# Altium schematic sheet [17]-ETH_CONNECTOR.SchDoc
size A4
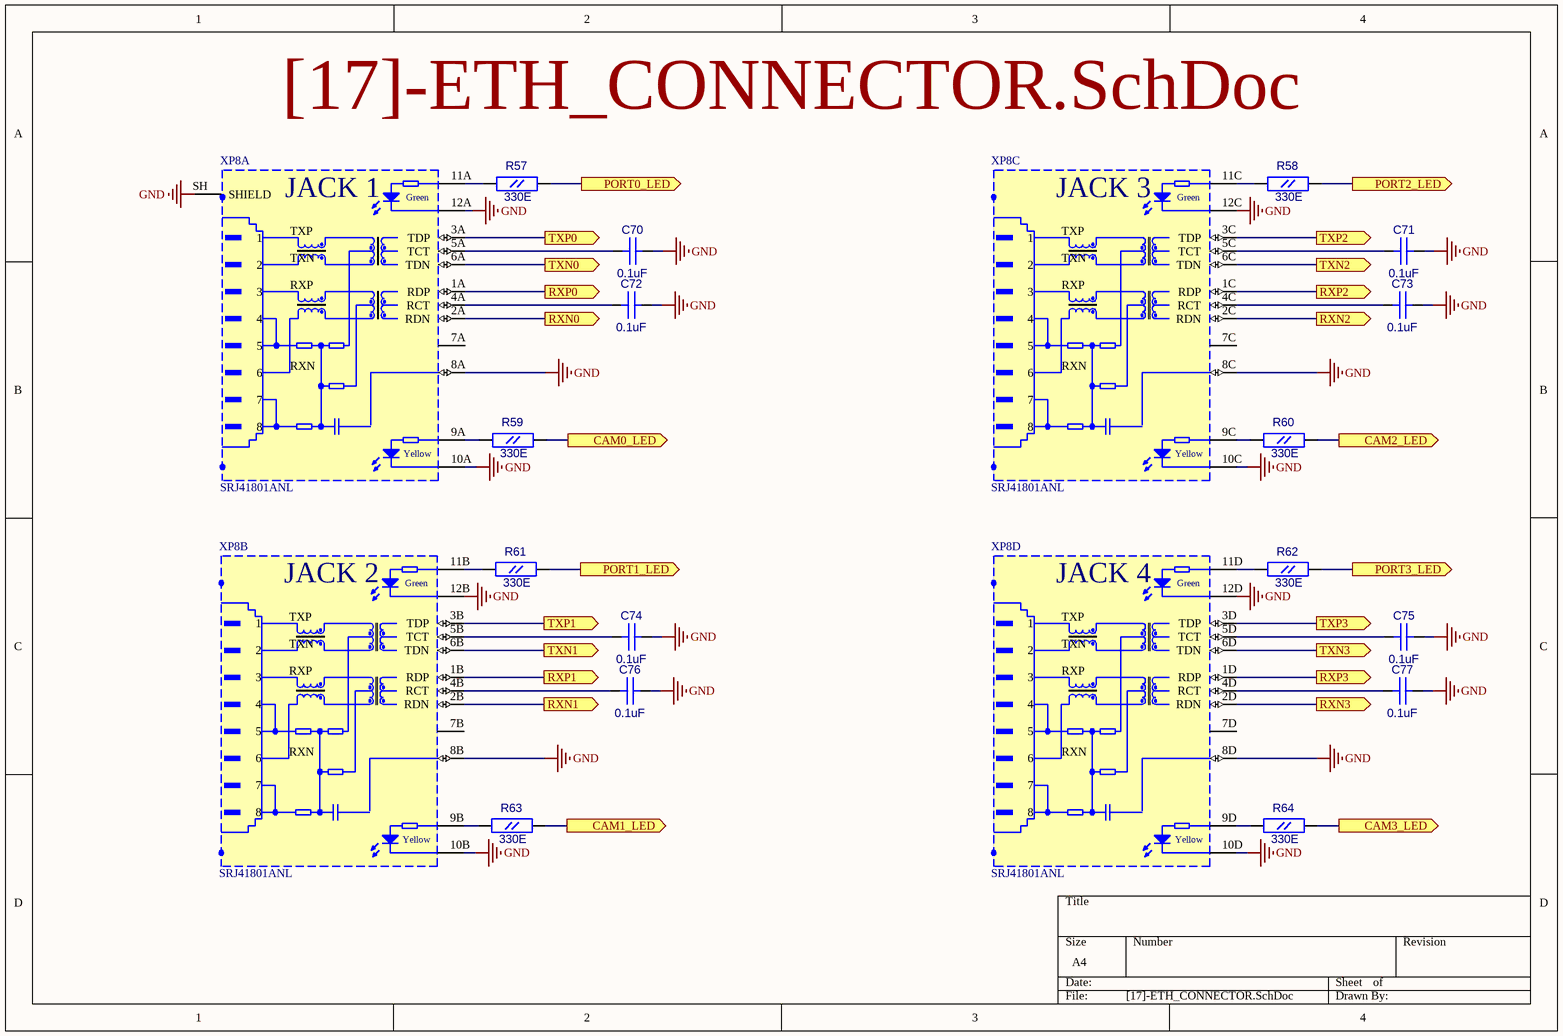
[diagram p0: [17]-ETH_CONNECTOR.SchDoc]

## Parts
C70  0.1uF  [CC0603]
C71  0.1uF  [CC0603]
C72  0.1uF  [CC0603]
C73  0.1uF  [CC0603]
C74  0.1uF  [CC0603]
C75  0.1uF  [CC0603]
C76  0.1uF  [CC0603]
C77  0.1uF  [CC0603]
R57  330E  [RC0603]
R58  330E  [RC0603]
R59  330E  [RC0603]
R60  330E  [RC0603]
R61  330E  [RC0603]
R62  330E  [RC0603]
R63  330E  [RC0603]
R64  330E  [RC0603]
XP8  SRJ41801ANL  [ETHERNET_RJ45_4PORTS]  (parts A,B,C,D of 4)

## Ports
CAM0_LED (out), CAM1_LED (out), CAM2_LED (out), CAM3_LED (out), PORT0_LED (out), PORT1_LED (out), PORT2_LED (out), PORT3_LED (out), RXN0 (out), RXN1 (out), RXN2 (out), RXN3 (out), RXP0 (out), RXP1 (out), RXP2 (out), RXP3 (out), TXN0 (out), TXN1 (out), TXN2 (out), TXN3 (out), TXP0 (out), TXP1 (out), TXP2 (out), TXP3 (out)

## Nets
GND: C70.2(B) C71.2(B) C72.2(B) C73.2(B) C74.2(B) C75.2(B) C76.2(B) C77.2(B) XP8.8A XP8.8B XP8.8C XP8.8D XP8.10A(D4) XP8.10B(D4) XP8.10C(D4) XP8.10D(D4) XP8.12A(D2) XP8.12B(D2) XP8.12C(D2) XP8.12D(D2) XP8.SH(SHIELD)
CAM0_LED: R59.2(B) ; port CAM0_LED
CAM1_LED: R63.2(B) ; port CAM1_LED
CAM2_LED: R60.2(B) ; port CAM2_LED
CAM3_LED: R64.2(B) ; port CAM3_LED
PORT0_LED: R57.2(B) ; port PORT0_LED
PORT1_LED: R61.2(B) ; port PORT1_LED
PORT2_LED: R58.2(B) ; port PORT2_LED
PORT3_LED: R62.2(B) ; port PORT3_LED
RXN0: XP8.2A(RDN) ; port RXN0
RXN1: XP8.2B(RDN) ; port RXN1
RXN2: XP8.2C(RDN) ; port RXN2
RXN3: XP8.2D(RDN) ; port RXN3
RXP0: XP8.1A(RDP) ; port RXP0
RXP1: XP8.1B(RDP) ; port RXP1
RXP2: XP8.1C(RDP) ; port RXP2
RXP3: XP8.1D(RDP) ; port RXP3
TXN0: XP8.6A(TDN) ; port TXN0
TXN1: XP8.6B(TDN) ; port TXN1
TXN2: XP8.6C(TDN) ; port TXN2
TXN3: XP8.6D(TDN) ; port TXN3
TXP0: XP8.3A(TDP) ; port TXP0
TXP1: XP8.3B(TDP) ; port TXP1
TXP2: XP8.3C(TDP) ; port TXP2
TXP3: XP8.3D(TDP) ; port TXP3
NetC70_1: C70.1(A) XP8.5A(TCT)
NetC71_1: C71.1(A) XP8.5C(TCT)
NetC72_1: C72.1(A) XP8.4A(RCT)
NetC73_1: C73.1(A) XP8.4C(RCT)
NetC74_1: C74.1(A) XP8.5B(TCT)
NetC75_1: C75.1(A) XP8.5D(TCT)
NetC76_1: C76.1(A) XP8.4B(RCT)
NetC77_1: C77.1(A) XP8.4D(RCT)
NetR57_1: R57.1(A) XP8.11A(D1)
NetR58_1: R58.1(A) XP8.11C(D1)
NetR59_1: R59.1(A) XP8.9A(D3)
NetR60_1: R60.1(A) XP8.9C(D3)
NetR61_1: R61.1(A) XP8.11B(D1)
NetR62_1: R62.1(A) XP8.11D(D1)
NetR63_1: R63.1(A) XP8.9B(D3)
NetR64_1: R64.1(A) XP8.9D(D3)

Not connected (* = marked no-connect by the designer): XP8 7A(7) 7B(7) 7C(7) 7D(7)

## Notes on the sheet
- (in symbol SRJ41801ANL, part A) Green; JACK 1; TXP; 1; TXN; 2; RXP; 3; 4; 5; RXN; 6; Yellow
- (in symbol SRJ41801ANL, part B) Green; JACK 2; TXP; 1; TXN; 2; RXP; 3; 4; 5; RXN; 6; Yellow
- (in symbol SRJ41801ANL, part C) Green; JACK 3; TXP; 1; TXN; 2; RXP; 3; 4; 5; RXN; 6; Yellow
- (in symbol SRJ41801ANL, part D) Green; JACK 4; TXP; 1; TXN; 2; RXP; 3; 4; 5; RXN; 6; Yellow

## Library data of the parts
C70-C77 = CC0603: Value: 0.1uF
R57-R64 = RC0603: Value: 330E
XP8 = SRJ41801ANL: 4 Ports RJ45 Ethernet connector; Value: SRJ41801ANL